# Altium schematic sheet MCP33151 Eval Board.SchDoc: MCP33151 Eval Board
size B; DrawnBy: Jasper Yun; SheetNumber: 10; SheetTotal: 9; Competition: SAC 2021; Subteam: Avionics; University: McGill University; Location: Montreal, Quebec; Project: Avionics Project Name; MRT: McGill Rocket Team
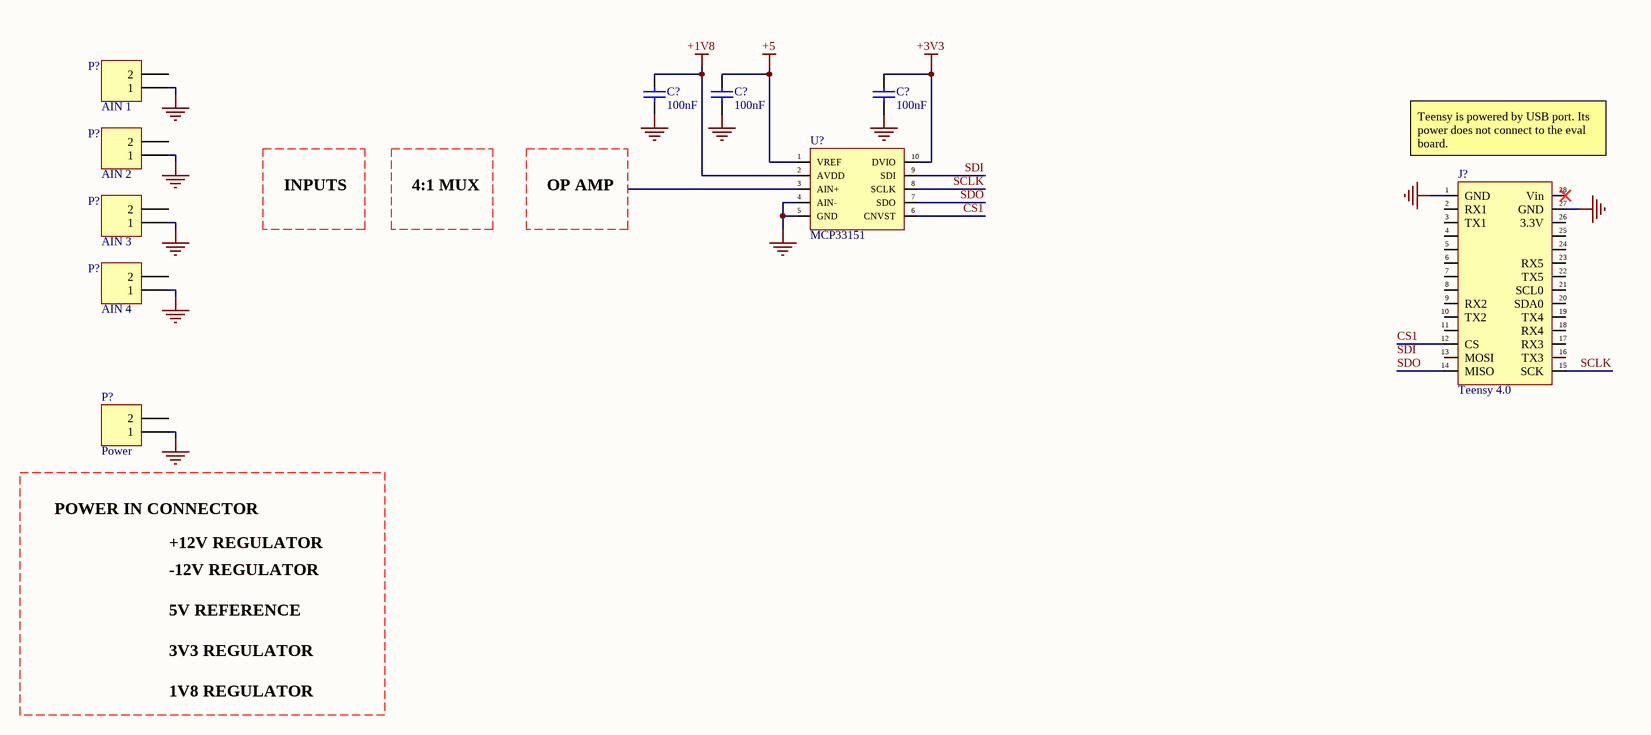
[diagram p0: MCP33151 Eval Board.SchDoc]

## Parts
(Parts that share a designator on the sheet are numbered #1, #2 ... from top to bottom, then left to right.)
C?#1  100nF  [RAD-0.3]
C?#2  100nF  [RAD-0.3]
C?#3  100nF  [RAD-0.3]
J?  Teensy 4.0  [Teensy 4.0]
P?#1  AIN 1  [Terminal Block 1935161 2-pos]
P?#2  AIN 2  [Terminal Block 1935161 2-pos]
P?#3  AIN 3  [Terminal Block 1935161 2-pos]
P?#4  AIN 4  [Terminal Block 1935161 2-pos]
P?#5  Power  [Terminal Block 1935161 2-pos]
U?  MCP33151

## Nets
+1V8: C?#1.1 U?.2(AVDD)
+3V3: C?#3.1 U?.10(DVIO)
+5: C?#2.1 U?.1(VREF)
GND: C?#1.2 C?#2.2 C?#3.2 J?.1(GND) J?.27(GND) P?#1.1 P?#2.1 P?#3.1 P?#4.1 P?#5.1 U?.4(AIN-) U?.5(GND)
CS1: J?.12(CS) U?.6(CNVST)
SCLK: J?.15(SCK) U?.8(SCLK)
SDI: U?.9(SDI)
SDO: J?.14(MISO) U?.7(SDO)

Not connected (* = marked no-connect by the designer): J? 2(RX1) 3(TX1) 4 5 6 7 8 9(RX2) 10(TX2) 11 13(MOSI) 16(TX3) 17(RX3) 18(RX4) 19(TX4) 20(SDA0) 21(SCL0) 22(TX5) 23(RX5) 24 25 26(3.3V) 28(Vin)*; P?#1 2; P?#2 2; P?#3 2; P?#4 2; P?#5 2; U? 3(AIN+)

## Notes on the sheet
- INPUTS
- 4:1 MUX
- OP AMP
- (near J?) Teensy is powered by USB port. Its power does not connect to the eval board.
- POWER IN CONNECTOR
- +12V REGULATOR
- -12V REGULATOR
- 5V REFERENCE
- 3V3 REGULATOR
- 1V8 REGULATOR
- Labels drawn without touching a wire or pin: SDI
- Title
- Size:
- Date:
- B
- Revision:
- Time:
- Drawn By:
- Sheet
- of
- File:

## Library data of the parts
C?#1-C?#3 = Cap: Capacitor; Published: 8-Jun-2000; LatestRevisionDate: 17-Jul-2002; LatestRevisionNote: Re-released for DXP Platform.; PackageReference: RAD-0.3; Publisher: Altium Limited; PackageDescription: Radial Cap, Thru-Hole; 2 Leads; 0.3 in Pin Spacing; Value: 100Nf
P?#1-P?#5 = Header 2: Header, 2-Pin; LatestRevisionDate: 17-Jul-2002; LatestRevisionNote: Re-released for DXP Platform.; Publisher: Altium Limited
U? = ADC MCP33151: ADC 14-bit SAR 1Msps 10-MSOP; Manufacturer: Microchip; Manufacturer Part Number: MCP33151-10-E/MS; Supplier 1: Arrow Electronics; RoHS: No; Category: Analog to Digital Converters (ADCs); Stock 1: 90; Pricing 1: 1=2.20600 (USD); Supplier Part Number 1: MCP33151-10-E/MS